# EAGLE design tfa_sensor_v12 (EAGLE 6.5.0)
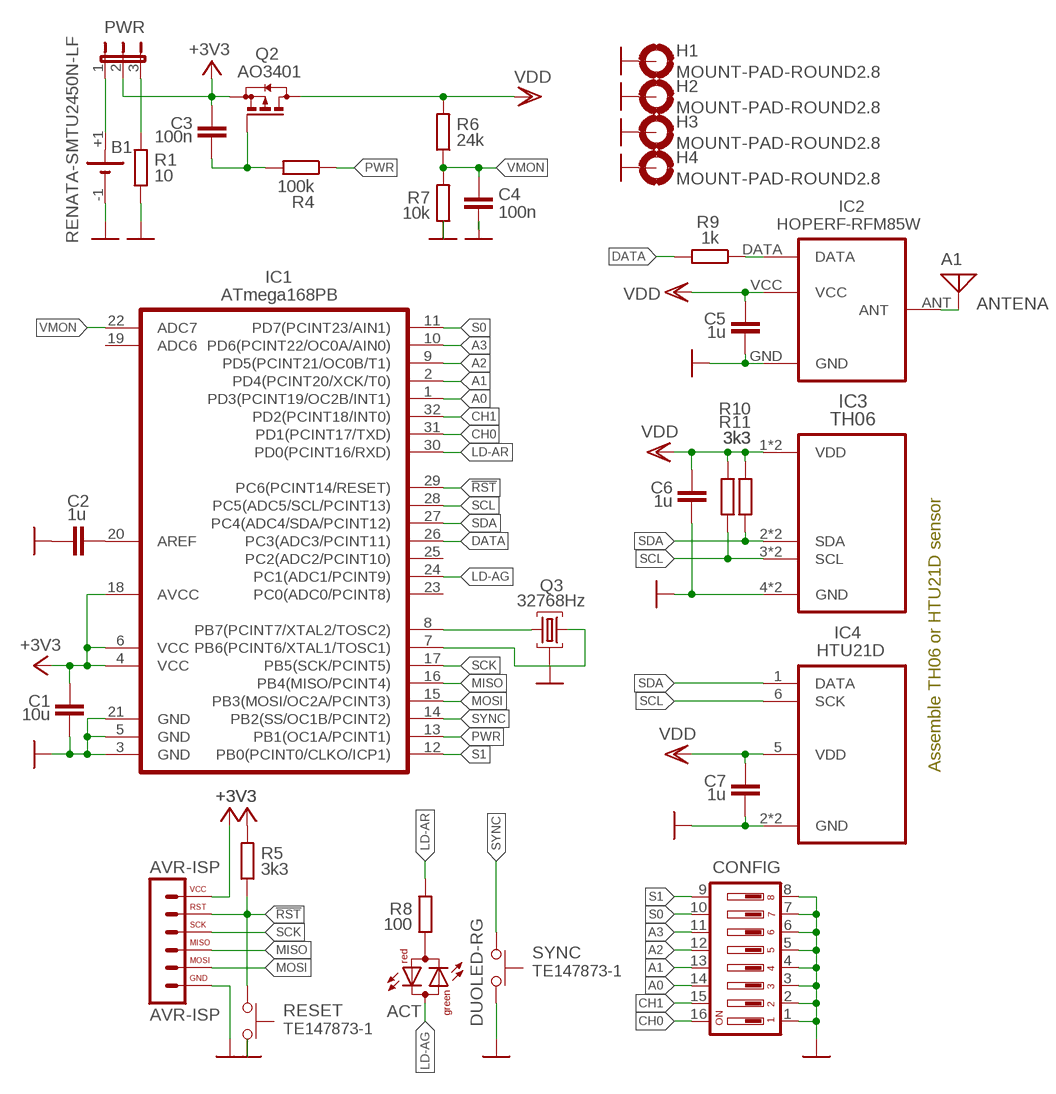
[diagram p0: schematic, sheet 1]

## Parts
A1  ANTENA  [ANT-433MHZ-SPIRAL]
ACT  DUOLED-RG  [LED3MM]
AVR-ISP  AVR-ISP  AVR_SPINRP  [SIL6-RNDPRESS]
B1  RENATA-SMTU2450N-LF  RENATA-HU1632-LF2450  [RENATA-SMTU2450N-LF]
C1  10u  C-EUC0805K  [C0805K]
C2  1u  C-EUC0805K  [C0805K]
C3  100n  C-EUC0603K  [C0603K]
C4  100n  C-EUC0603K  [C0603K]
C5  1u  C-EUC0805K  [C0805K]
C6  1u  C-EUC0805K  [C0805K]
C7  1u  C-EUC0603K  [C0603K]
CONFIG  DIP08YL  [DIP08YL]
H1  MOUNT-PAD-ROUND2.8  [2,8-PAD]
H2  MOUNT-PAD-ROUND2.8  [2,8-PAD]
H3  MOUNT-PAD-ROUND2.8  [2,8-PAD]
H4  MOUNT-PAD-ROUND2.8  [2,8-PAD]
IC1  ATmega168PB  ATMEGA88T  [TQFP32]
IC2  HOPERF-RFM85W  [HOPERF-RFM85W]
IC3  TH06  [TH06]
IC4  HTU21D  [DFN6-RH]
PWR  JP2EB  [JP2YB]
Q2  AO3401  BSS84  [SOT23]
Q3  32768Hz  CMJ206T  [CMJ206T]
R1  10  R-EU_R0805  [R0805]
R4  100k  R-EU_R0603  [R0603]
R5  3k3  R-EU_R0603  [R0603]
R6  24k  R-EU_R0603  [R0603]
R7  10k  R-EU_R0603  [R0603]
R8  100  R-EU_R0603  [R0603]
R9  1k  R-EU_R0603  [R0603]
R10  3k3  R-EU_R0603  [R0603]
R11  3k3  R-EU_R0603  [R0603]
RESET  TE147873-1  CUDL1TE147873-1  [TE-147873-1]
SYNC  TE147873-1  CUDL1_A  [CUDL1]

## Nets
!RST [tfa]: AVR-ISP.5 IC1.29(PC6(PCINT14/RESET)) R5.1 RESET.P$2
+3V3 [tfa]: AVR-ISP.6 C1.1 C3.1 IC1.4(VCC) IC1.6(VCC) IC1.18(AVCC) PWR.2 Q2.2(S) R5.2
A0 [tfa]: CONFIG.14 IC1.1(PD3(PCINT19/OC2B/INT1))
A1 [tfa]: CONFIG.13 IC1.2(PD4(PCINT20/XCK/T0))
A2 [tfa]: CONFIG.12 IC1.9(PD5(PCINT21/OC0B/T1))
A3 [tfa]: CONFIG.11 IC1.10(PD6(PCINT22/OC0A/AIN0))
ANT [tfa-ant]: A1.P$1 IC2.ANT
CH0 [tfa]: CONFIG.16 IC1.31(PD1(PCINT17/TXD))
CH1 [tfa]: CONFIG.15 IC1.32(PD2(PCINT18/INT0))
DATA [tfa]: IC1.26(PC3(ADC3/PCINT11)) R9.2
GND [tfa]: AVR-ISP.1 B1.-1(-) C1.2 C2.1 C4.2 C5.2 C6.2 C7.2 CONFIG.1 CONFIG.2 CONFIG.3 CONFIG.4 CONFIG.5 CONFIG.6 CONFIG.7 CONFIG.8 H1.B2,8(MOUNT) H2.B2,8(MOUNT) H3.B2,8(MOUNT) H4.B2,8(MOUNT) IC1.3(GND) IC1.5(GND) IC1.21(GND) IC2.GND IC3.4(GND) IC3.14(GND) IC4.2(GND) IC4.EP(GND) Q3.S R1.2 R7.1 RESET.P$1 SYNC.1 SYNC.2
LD-AG [tfa]: ACT.K(C) IC1.24(PC1(ADC1/PCINT9))
LD-AR [tfa]: IC1.30(PD0(PCINT16/RXD)) R8.2
MISO [tfa]: AVR-ISP.3 IC1.16(PB4(MISO/PCINT4))
MOSI [tfa]: AVR-ISP.2 IC1.15(PB3(MOSI/OC2A/PCINT3))
N$1 [tfa]: B1.+1(+) PWR.1
N$2 [tfa]: PWR.3 R1.1
N$3 [tfa]: ACT.A R8.1
N$4 [tfa]: IC1.8(PB7(PCINT7/XTAL2/TOSC2)) Q3.X2
N$5 [tfa]: IC1.7(PB6(PCINT6/XTAL1/TOSC1)) Q3.X1
N$6 [tfa]: C2.2 IC1.20(AREF)
N$7 [tfa]: IC2.DATA R9.1
N$37 [tfa]: C3.2 Q2.1(G) R4.2
PWR [tfa]: IC1.13(PB1(OC1A/PCINT1)) R4.1
S0 [tfa]: CONFIG.10 IC1.11(PD7(PCINT23/AIN1))
S1 [tfa]: CONFIG.9 IC1.12(PB0(PCINT0/CLKO/ICP1))
SCK [tfa]: AVR-ISP.4 IC1.17(PB5(SCK/PCINT5))
SCL [tfa]: IC1.28(PC5(ADC5/SCL/PCINT13)) IC3.3(SCL) IC3.13(SCL) IC4.6(SCK) R10.2
SDA [tfa]: IC1.27(PC4(ADC4/SDA/PCINT12)) IC3.2(SDA) IC3.12(SDA) IC4.1(DATA) R11.2
SYNC [tfa]: IC1.14(PB2(SS/OC1B/PCINT2)) SYNC.3 SYNC.4
VDD [tfa]: C5.1 C6.1 C7.1 IC2.VCC IC3.1(VDD) IC3.11(VDD) IC4.5(VDD) Q2.3(D) R6.2 R10.1 R11.1
VMON [tfa]: C4.1 IC1.22(ADC7) R6.1 R7.2
Unconnected: IC1.19(ADC6) IC1.23(PC0(ADC0/PCINT8)) IC1.25(PC2(ADC2/PCINT10))

## Notes on the sheet
- Assemble TH06 or HTU21D sensor

## Library data of the parts
A1 = ostatni:ANTENA
ACT = led:DUOLED-RG
AVR-ISP = ostatni:AVR_SPI: SPI rozhranni pro muj kua programator AVR.
B1 = battery:RENATA-HU1632-LF: Renata holder for 1632 cells.
C1-C7 = rcl:C-EU: CAPACITOR, European symbol
CONFIG = switch-dil:DIP08YL: DIL/CODE SWITCH; OC_FARNELL: unknown; OC_NEWARK: unknown
H1-H4 = holes:MOUNT-PAD-ROUND: MOUNTING PAD, round
IC1 = ostatni:ATMEGA88T
IC2 = ostatni:HOPERF-RFM85W
IC3 = ostatni:TH06: Digital temperature and RH sensor I2C, 3V3.
IC4 = ostatni:HTU21D: Combined temperature and RH sensor. I2C bus.
PWR = jumper:JP2E: JUMPER
Q2 = transistor-small-signal:BSS84: P-CHANNEL MOS FET
Q3 = crystal:CMJ206T: 32.768kHz crystall with shield.
R1 R4-R11 = rcl:R-EU_: RESISTOR, European symbol
RESET SYNC = butony:CUDL1

## Net classes
14 tfa: clearance 0.254 mm
15 tfa-ant: clearance 1.27 mm

## Board
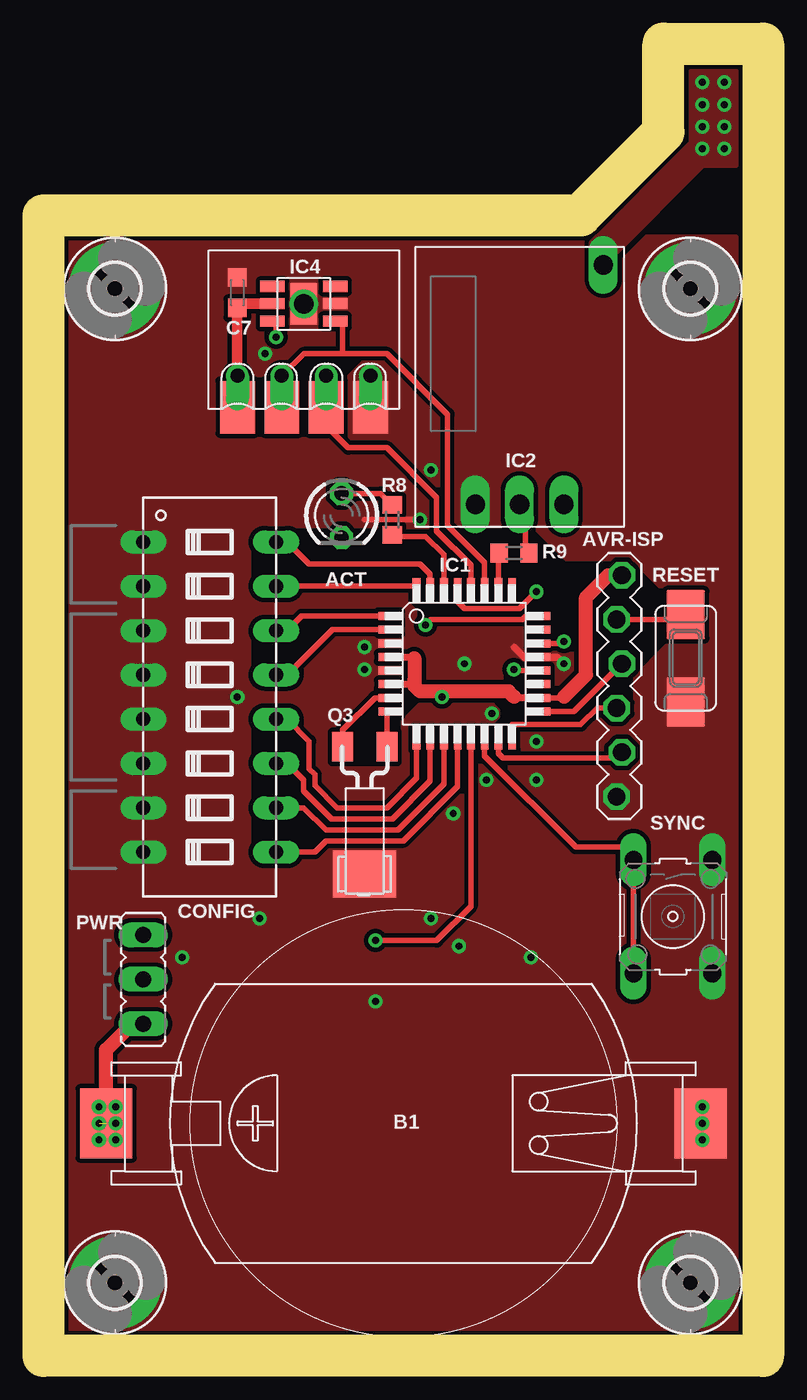
[diagram p1: board, top side]
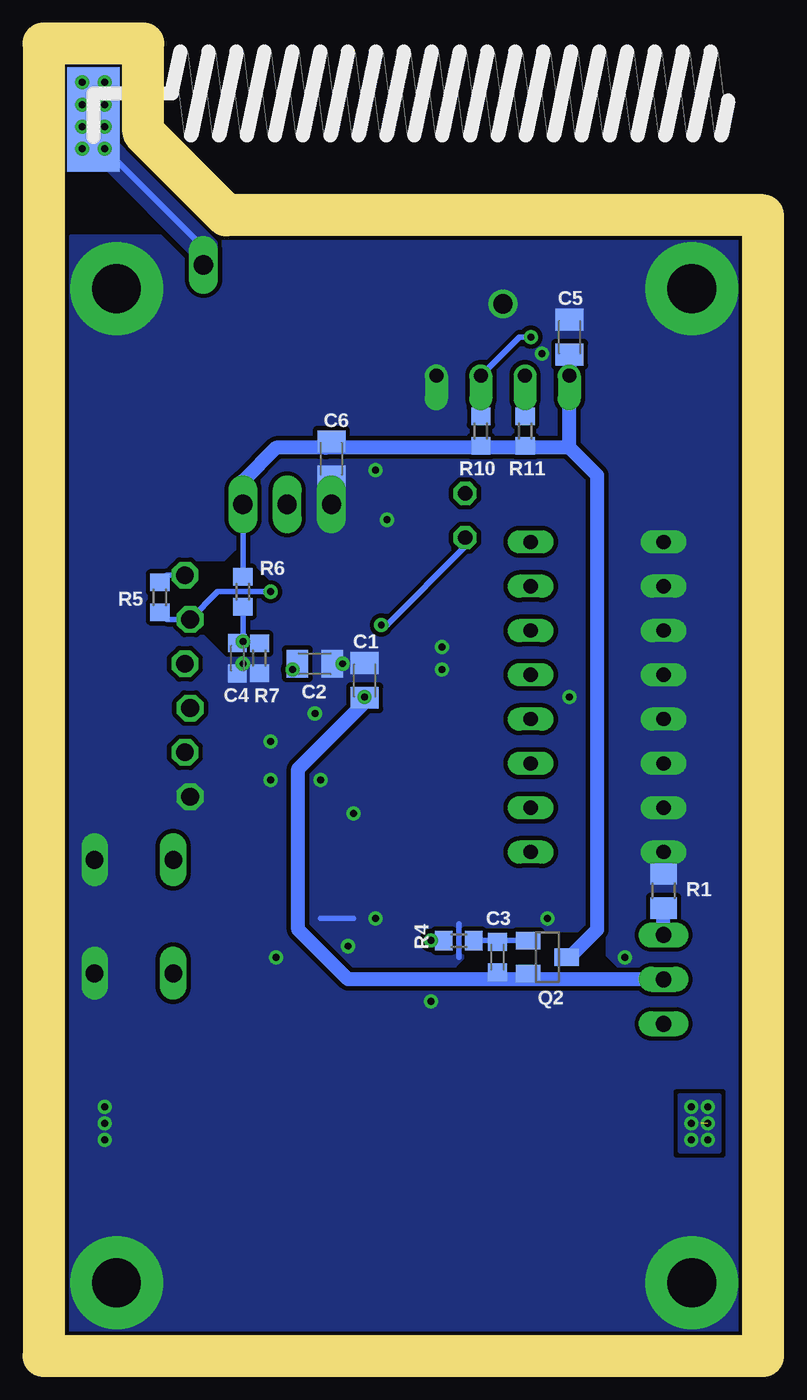
[diagram p2: board, bottom side, seen from below]

Size 41.27 x 75.25 mm. Coordinates in mm from the lower left corner, seen from the top.
Outline: 0,65.41 30.8,65.41 35.56,70.17 35.56,75.25 41.27,75.25 41.27,0 0,0 0,65.41
Copper layers (1*16): Top 0.035mm / dielectric 1.5mm / Bottom 0.035mm
Design rules "default *": minimum track width 10mil, minimum drill 24mil, track to track 8mil, track to pad 8mil, pad to pad 8mil, via to via 8mil, smd to smd 8mil, copper to edge 8mil, drill to drill 8mil, minimum pad ring 10mil, minimum via ring 8mil, stop-mask expansion 4mil, vias tented up to drill 0mil, thermal gap 10mil
tRestrict: 22 lines
bRestrict: 11 lines

### Footprints (pad centres in the part's own frame; a part is rotated, then mirrored left to right if it is on the bottom)
ANT-433MHZ-SPIRAL = smd 3 x 6: P$1 0,-1.5
LED3MM = drill 0.813 octagon: A -1.27,0; K 1.27,0
SIL6-RNDPRESS = drill 1.016 octagon: 1 -6.35,0.15; 2 -3.81,-0.15; 3 -1.27,0.15; 4 1.27,-0.15; 5 3.81,0.15; 6 6.35,-0.15
RENATA-SMTU2450N-LF = smd 3 x 4: +1 -17.05,0; -1 17.05,0
C0805K = smd 1.25 x 1.6: 1 -1,0; 2 1,0
C0603K = smd 1.05 x 1.08: 1 -0.875,0; 2 0.875,0
DIP08YL = drill 0.813 long: 1 -8.89,-3.81; 2 -6.35,-3.81; 3 -3.81,-3.81; 4 -1.27,-3.81; 5 1.27,-3.81; 6 3.81,-3.81; 7 6.35,-3.81; 8 8.89,-3.81; 9 8.89,3.81; 10 6.35,3.81; 11 3.81,3.81; 12 1.27,3.81; 13 -1.27,3.81; 14 -3.81,3.81; 15 -6.35,3.81; 16 -8.89,3.81
2,8-PAD = drill 2.8 pad 5.334: B2,8 0,0
TQFP32 = smd 1.27 x 0.45: 1 -4.293,2.743; 2 -4.293,1.956; 3 -4.293,1.168; 4 -4.293,0.381; 5 -4.293,-0.381; 6 -4.293,-1.168; 7 -4.293,-1.956; 8 -4.293,-2.743; 17 4.293,-2.743; 18 4.293,-1.956; 19 4.293,-1.168; 20 4.293,-0.381; 21 4.293,0.381; 22 4.293,1.168; 23 4.293,1.956; 24 4.293,2.743 | smd 0.45 x 1.27: 9 -2.743,-4.293; 10 -1.956,-4.293; 11 -1.168,-4.293; 12 -0.381,-4.293; 13 0.381,-4.293; 14 1.168,-4.293; 15 1.956,-4.293; 16 2.743,-4.293; 25 2.743,4.293; 26 1.956,4.293; 27 1.168,4.293; 28 0.381,4.293; 29 -0.381,4.293; 30 -1.168,4.293; 31 -1.956,4.293; 32 -2.743,4.293
HOPERF-RFM85W = drill 1.1 long: ANT 7,-4.8; DATA -6.73,0; GND -6.73,2.54; VCC -6.73,-2.54
TH06 = drill 0.8 offset: 1 -3.8,0; 2 -1.26,0; 3 1.28,0; 4 3.82,0 | smd 2 x 3: 11 -3.8,-1.8; 12 -1.26,-1.8; 13 1.28,-1.8; 14 3.82,-1.8
DFN6-RH = smd 1.4 x 0.635: 1 -1.8,1; 2 -1.8,0; 3 -1.8,-1; 4 1.8,-1; 5 1.8,0; 6 1.8,1 | smd 1.5 x 2.4: EP 0,0
JP2YB = drill 0.914 long: 1 -2.54,0; 2 0,0; 3 2.54,0
SOT23 = smd 1 x 1.4: 1 -0.95,-1.1; 2 0.95,-1.1; 3 0,1.1
CMJ206T = smd 2.7 x 3.6: S -3.48,0 | smd 1.7 x 1.2: X1 3.81,1.27; X2 3.81,-1.27
R0805 = smd 1.25 x 1.5: 1 -1,0; 2 1,0
R0603 = smd 1 x 1.1: 1 -0.85,0; 2 0.85,0
TE-147873-1 = smd 2.8 x 2.2: P$1 -2.5,0; P$2 2.5,0
CUDL1 = drill 1.016 long: 1 -3.251,2.261; 2 3.251,2.261; 3 -3.251,-2.261; 4 3.251,-2.261

### Placement (x,y rotation side)
A1  38.42,72.39 0 bottom
ACT  17.09,48.19 270 top
AVR-ISP  33.02,38.42 90 top
B1  20.64,13.33 0 top
C1  22.86,38.73 90 bottom
C2  25.72,39.69 180 bottom
C3  15.24,22.86 90 bottom
C4  30.16,40 270 bottom
C5  11.11,58.42 90 bottom
C6  24.77,51.43 270 bottom
C7  11.11,60.96 90 top
CONFIG  9.53,37.78 270 top
H1  4.09,4.19 0 top
H2  4.09,61.19 0 top
H3  37.09,61.19 0 top
H4  37.09,4.19 0 top
IC1  24.13,39.69 0 top
IC2  27.3,55.56 90 top
IC3  14.92,56.2 0 top
IC4  14.92,60.33 180 top
PWR  5.71,21.59 90 top
Q2  12.38,22.86 270 bottom
Q3  18.41,31.11 90 top
R1  5.71,26.67 90 bottom
R4  17.46,23.81 0 bottom
R5  34.61,43.5 90 bottom
R6  29.84,43.81 90 bottom
R7  28.89,40 90 bottom
R8  20,47.94 270 top
R9  26.99,46.04 180 top
R10  16.19,53.02 90 bottom
R11  13.65,53.02 90 bottom
RESET  36.83,40 90 top
SYNC  36.09,25.19 270 top

### Tracks (layer width: path | path; a pad name or v marks a point on that pad's centre or on a via)
!RST  (via drill 0.4)
  Top 0.305: IC1.29 23.75,43.24 24.13,42.86 27.3,42.86 v28.26,43.81 | RESET.P$2 36.83,42.23 AVR-ISP.5
  Bottom 0.305: v28.26,43.81 31.28,43.81 AVR-ISP.5 34.19,42.23 R5.1
+3V3  (via drill 0.4)
  Top 0.305: IC1.18 29.79,37.73 29.84,37.78 | v22.86,37.78 22.86,38.1
  Top 0.406: IC1.4 21.21,40.07 21.27,40 | IC1.18 27.04,37.73 26.99,37.78 | IC1.6 21.06,38.52 21.27,38.73
  Top 0.813: 21.27,40 21.27,38.73 21.27,38.42 21.59,38.1 22.86,38.1 26.67,38.1 26.99,37.78 | 29.84,37.78 31.12,39.05 31.12,43.5 32.38,44.77 AVR-ISP.6
  Bottom 0.305: R5.2 34.19,44.77 AVR-ISP.6 | C1.1 v22.86,37.78
  Bottom 0.813: PWR.2 13.65,21.59 | 13.65,21.59 15.24,21.59 | Q2.2 13.48,21.76 13.65,21.59 | C3.1 15.24,21.59 | 15.24,21.59 23.81,21.59 26.67,24.45 26.67,33.66 22.86,37.46 v22.86,37.78
A0
  Top 0.305: IC1.1 14.81,42.43 13.97,41.59 CONFIG.14
A1
  Top 0.305: IC1.2 16.56,41.64 13.97,39.05 CONFIG.13
A2
  Top 0.305: IC1.9 21.39,33.13 19.68,31.43 16.83,31.43 15.56,32.7 15.56,33.34 15.24,33.66 15.24,35.24 13.97,36.51 CONFIG.12
A3
  Top 0.305: CONFIG.11 13.97,33.97 14.92,33.02 14.92,32.38 16.51,30.8 20,30.8 22.17,32.97 IC1.10
ANT  (via drill 0.4)
  Bottom 0.305: IC2.ANT 32.1,63.54 v37.78,69.22
  other vias: 37.78,73.02 39.05,73.02 37.78,71.75 39.05,71.75 39.05,70.48 37.78,70.48 39.05,69.22
  pour Top (no thermals): 37.15,73.66 39.69,73.66 39.69,68.26 37.78,68.26 32.7,63.18 32.7,61.91 31.43,61.91 31.43,63.82 37.15,69.53
  pour Bottom (no thermals): 37.15,73.66 39.69,73.66 39.69,68.26 37.78,68.26 32.7,63.18 32.7,61.91 31.43,61.91 31.43,63.82 37.15,69.53
CH0
  Top 0.305: IC1.31 22.17,44.82 21.59,45.4 15.24,45.4 13.97,46.67 CONFIG.16
CH1
  Top 0.305: IC1.32 21.39,44.02 21.27,44.13 CONFIG.15
DATA
  Top 0.305: IC1.26 26.09,46.04 R9.2
GND  (via drill 0.4, 1.1)
  Top 0.305: v21.59,47.94 18.41,47.94
  Top 0.406: 26.99,40.64 27.56,40.07 IC1.21 29.46,40.07 v29.84,39.69
  Bottom 0.254: 12.38,24.77 v12.38,25.08
  Bottom 0.305: 23.49,25.08 25.4,25.08 | 17.46,24.77 17.46,22.86
  Bottom 0.406: v29.84,39.69 C4.2
  other vias: 37.78,12.38 37.78,14.29 23.81,23.5 24.13,39.69 22.22,25.08 25.4,33.02 27.94,22.86 19.05,20.32 7.94,22.86 18.41,39.37 18.41,40.64 28.26,35.24 28.26,33.02 25.72,36.83 22.22,50.8 11.11,37.78 23.49,31.11 37.78,13.33 14.92,60.33 12.7,57.47
  pour Bottom (rank 3, no thermals): 1.59,64.13 39.69,64.13 39.69,0.95 1.59,0.95
  pour Top (rank 3, no thermals): 1.59,64.13 39.69,64.13 39.69,0.95 1.59,0.95
LD-AG  (via drill 0.4)
  Top 0.305: IC1.24 27.67,42.43 27.46,42.23 22.22,42.23 v21.91,41.91
  Bottom 0.305: v21.91,41.91 21.59,41.91 17.09,46.41 ACT.K
LD-AR
  Top 0.305: IC1.30 22.96,45.94 21.91,46.99 19.79,46.99 R8.2
MISO
  Top 0.305: IC1.16 26.87,36.2 30.8,36.2 31.75,37.15 AVR-ISP.3
MOSI
  Top 0.305: IC1.15 26.09,34.56 26.35,34.29 32.85,34.29 AVR-ISP.2
N$1  (via drill 0.4)  (1 unrouted)
  Top 0.813: B1.+1 3.59,17.56 5.08,19.05 PWR.1
  other vias: 3.17,14.29 4.13,14.29 4.13,13.33 3.17,13.33 3.17,12.38 4.13,12.38
  pour Bottom (no thermals): 2.54,14.92 4.76,14.92 4.76,11.75 2.54,11.75
N$2
  Bottom 0.813: PWR.3 R1.1
N$3
  Top 0.305: ACT.A 19.33,49.46 R8.1
N$4
  Top 0.305: IC1.8 19.8,36.94 19.68,36.83 Q3.X2
N$5
  Top 0.305: IC1.7 19,37.73 17.14,35.88 Q3.X1
N$6  (via drill 0.4)
  Top 0.305: IC1.20 27.24,39.31 v26.99,39.37
  Bottom 0.305: v26.99,39.37 26.67,39.64 C2.2
N$7
  Top 0.305: IC2.DATA 27.62,48.52 27.62,46.25 R9.1
N$37
  Bottom 0.305: Q2.1 15.24,23.81 | 15.24,23.81 R4.2 | C3.2 15.24,23.81
PWR  (via drill 0.4)
  Top 0.305: IC1.13 24.51,25.78 22.54,23.81 v19.05,23.81
  Bottom 0.305: 19.05,23.71 v19.05,23.81 R4.1
S0
  Top 0.305: IC1.11 22.96,32.8 20.32,30.16 16.19,30.16 14.92,31.43 CONFIG.10
S1
  Top 0.305: CONFIG.9 15.56,28.89 16.19,29.53 20.64,29.53 23.75,32.64 IC1.12
SCK
  Top 0.305: IC1.17 30.43,36.94 AVR-ISP.4
SCL  (via drill 0.4)
  Top 0.305: IC3.3 IC3.13 16.19,54.39 16.19,53.34 17.46,52.07 19.68,52.07 22.54,49.21 22.54,47.31 24.51,45.34 IC1.28 | IC4.6 13.29,59.32 13.34,59.37 v13.34,58.42
  Bottom 0.305: R10.2 16.19,56.19 IC3.3 13.98,58.42 v13.34,58.42
SDA
  Top 0.305: IC1.27 25.3,45.5 23.18,47.62 23.18,53.97 19.68,57.47 17.14,57.47 | 17.14,57.47 14.93,57.47 IC3.2 IC3.12 | IC4.1 17.1,59.32 17.14,59.37 17.14,57.47
  Bottom 0.305: R11.2 13.65,56.19 IC3.2
SYNC
  Top 0.305: IC1.14 25.3,34.39 30.52,29.17 33.7,29.17 34.29,28.57 SYNC.3 SYNC.4
VDD
  Top 0.305: IC3.11 IC3.1
  Top 0.61: IC4.5 11.11,60.33 C7.1 11.11,60.01 11.11,56.21 IC3.1
  Bottom 0.305: IC2.VCC R6.2 | C6.1 24.77,52.39 25.08,52.07
  Bottom 0.813: Q2.3 11.11,22.86 9.53,24.45 9.53,50.48 11.11,52.07 | 11.11,52.07 11.11,56.19 IC3.1 11.11,56.21 C5.1 | 11.11,52.07 13.55,52.07 R11.1 13.65,52.07 16.09,52.07 R10.1 16.19,52.07 25.08,52.07 27.94,52.07 29.84,50.16 IC2.VCC
VMON  (via drill 0.4)
  Top 0.305: IC1.22 29.74,40.86 v29.84,40.96
  Bottom 0.305: v29.84,40.96 29.92,40.96 C4.1 | R7.2 28.57,40.96 v29.84,40.96 | R6.1 v29.84,40.96

### Text on the board
tDocu: S=0: 1min / S=1: 2min / S=2: 5min / S=3: 10min | CH: Chn. ID / A: Sens. ID / S: Rep. speed | A=0: random / A>0: fixed | CH0 | AG | 25 | +3V | CH1 | 32 | 24 | 1 | RST | A0 | (randomize ID) | A1 | SCK | 8 | MISO | A2 | 17 | A3 | 9 | 16 | MOSI | GND | S0 | TFA | S1 | Dostmann 30.3215.02 / Compatible Sensor / V1.2, 2025-01-19 / (c) Stanislav Maslan | OFF | ON | + | - | Renata 2450n 3V